# Altium schematic sheet Flash_memory.SchDoc
size A4
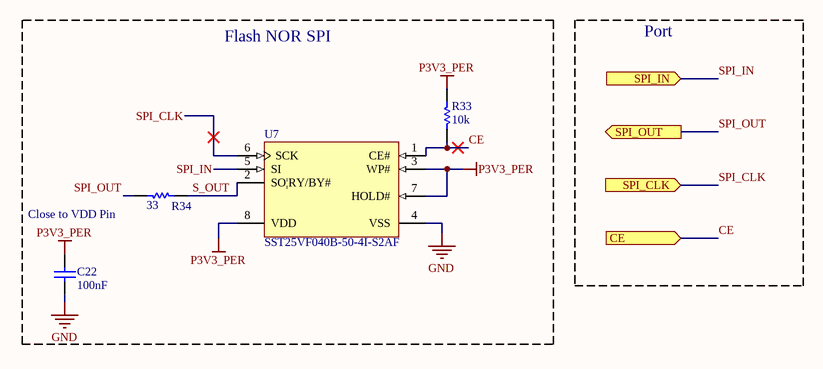
[diagram p0: Flash_memory.SchDoc]

## Parts
C22  100nF  [0603C]
R33  10k  [0603R]
R34  33  [0603R]
U7  SST25VF040B-50-4I-S2AF  [MCHP-SOIC-S2A8_N]

## Ports
CE (in), SPI_CLK (in), SPI_IN (in), SPI_OUT (out)

## Nets
GND: C22.1 U7.4(VSS)
P3V3_PER: C22.2 R33.2 U7.3(WP#) U7.7(HOLD#) U7.8(VDD)
CE: R33.1 U7.1(CE#) ; port CE
S_OUT: R34.2 U7.2(SO|RY/BY#)
SPI_CLK: U7.6(SCK) ; port SPI_CLK
SPI_IN: U7.5(SI) ; port SPI_IN
SPI_OUT: R34.1 ; port SPI_OUT

## Notes on the sheet
- Flash NOR SPI
- Port
- (near R34) Close to VDD Pin

## Library data of the parts
C22 = Capacitor_ST: Capacitor 0402 / 0603 / 0805; Revision: July-2002: Re-released for DXP Platform.; Value: 100nF
R33 R34 = Res1: Resistor; Value: 1K; Published: 8-Jun-2000; Revision: July-2002: Re-released for DXP Platform.; Publisher: Altium Limited
U7 = CMP-0378-00057-1: 4 Mbit SPI Serial Flash, 2.7 to 3.6 V, 50 MHz, -40 to 85 degC, 8-pin SOIC (S2A8), Tube; Manufacturer: Microchip; DatasheetVersion: Rev. A; ComponentLink3Description: Package Specification; ComponentLink1Description: Manufacturer URL; PackageDescription: 8-Lead Plastic Small Outline Intergrated Circuit, 5.275 x 5.275 mm Body, 1.27 mm Pitch; ComponentLink3URL: http://ww1.microchip.com/downloads/en/DeviceDoc/25051A.pdf; PartNumber: SST25VF040B-50-4I-S2AF; ComponentLink2URL: http://ww1.microchip.com/downloads/en/DeviceDoc/25051A.pdf; ComponentLink1URL: http://www.microchip.com; ComponentLink2Description: Datasheet; ComponentLink4Description: Product URL; PackageReference: SOIC-S2A8; ComponentLink4URL: http://www.microchip.com/SST25VF040B; Mounting Technology: Surface Mount; PackageVersion: Rev. A